# Altium schematic sheet PrimerPCB12.SchDoc
size A4
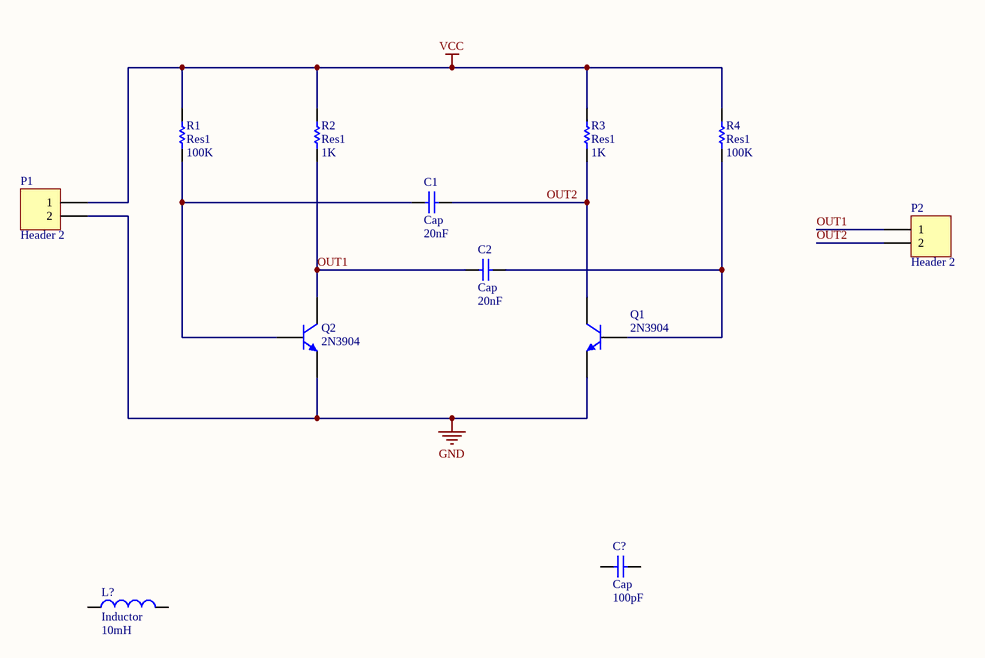
[diagram p0: PrimerPCB12.SchDoc]

## Parts
C1  Cap  value 20nF  [RAD-0.1]
C2  Cap  value 20nF  [RAD-0.1]
C?  Cap  value 100pF  [RAD-0.3]
L?  Inductor  value 10mH  [0402-A]
P1  Header 2  [HDR1X2]
P2  Header 2  [HDR1X2]
Q1  2N3904  [TO-92A]
Q2  2N3904  [TO-92A]
R1  Res1  value 100K  [AXIAL-0.3]
R2  Res1  value 1K  [AXIAL-0.3]
R3  Res1  value 1K  [AXIAL-0.3]
R4  Res1  value 100K  [AXIAL-0.3]

## Nets
GND: P1.2 Q1.1(E) Q2.1(E)
VCC: P1.1 R1.2 R2.2 R3.2 R4.2
OUT1: C2.1 P2.1 Q2.3(C) R2.1
OUT2: C1.2 P2.2 Q1.3(C) R3.1
NetC1_1: C1.1 Q2.2(B) R1.1
NetC2_2: C2.2 Q1.2(B) R4.1

Not connected (* = marked no-connect by the designer): C? 1 2; L? 1 2

## Library data of the parts
C1 C2 C? = Cap: Capacitor; Published: 8-Jun-2000; LatestRevisionDate: 17-Jul-2002; LatestRevisionNote: Re-released for DXP Platform.; PackageReference: RAD-0.3; Publisher: Altium Limited; PackageDescription: Radial Cap, Thru-Hole; 2 Leads; 0.3 in Pin Spacing
L? = Inductor: Code_IEC: 1005; Published: 8-Jun-2000; LatestRevisionDate: 29-May-2009; LatestRevisionNote: IPC-7351 Footprint Added.; PackageReference: 0402-A; Publisher: Altium Limited; PackageDescription: Chip Inductor; Code_JEITA: 0402
P1 P2 = Header 2: Header, 2-Pin; LatestRevisionDate: 17-Jul-2002; LatestRevisionNote: Re-released for DXP Platform.; Publisher: Altium Limited
Q1 Q2 = 2N3904: NPN General Purpose Amplifier; Published: 8-Jun-2000; LatestRevisionDate: 15-Jan-2003; LatestRevisionNote: PCB Footprint 'BCY-W3/D4.7' replaced; DatasheetVersion: 1997; PackageVersion: Sep-1998; PackageReference: TO-92A; Publisher: Altium Limited; PackageDescription: TO, Flat Index; 3 In-Line, Axial Leads; Body Dia. 4.5mm; Leads 0.51 x 0.48 mm (max); ComponentLink1Description: Manufacturer Link; ComponentLink1URL: http://www.fairchildsemi.com/; ComponentLink2Description: Datasheet; ComponentLink2URL: http://www.fairchildsemi.com/ds/2N%2F2N3904.pdf
R1-R4 = Res1: Resistor; Published: 8-Jun-2000; LatestRevisionDate: 17-Jul-2002; LatestRevisionNote: Re-released for DXP Platform.; PackageReference: AXIAL-0.3; Publisher: Altium Limited; PackageDescription: Axial Device, Thru-Hole; 2 Leads; 0.3 in Pin Spacing